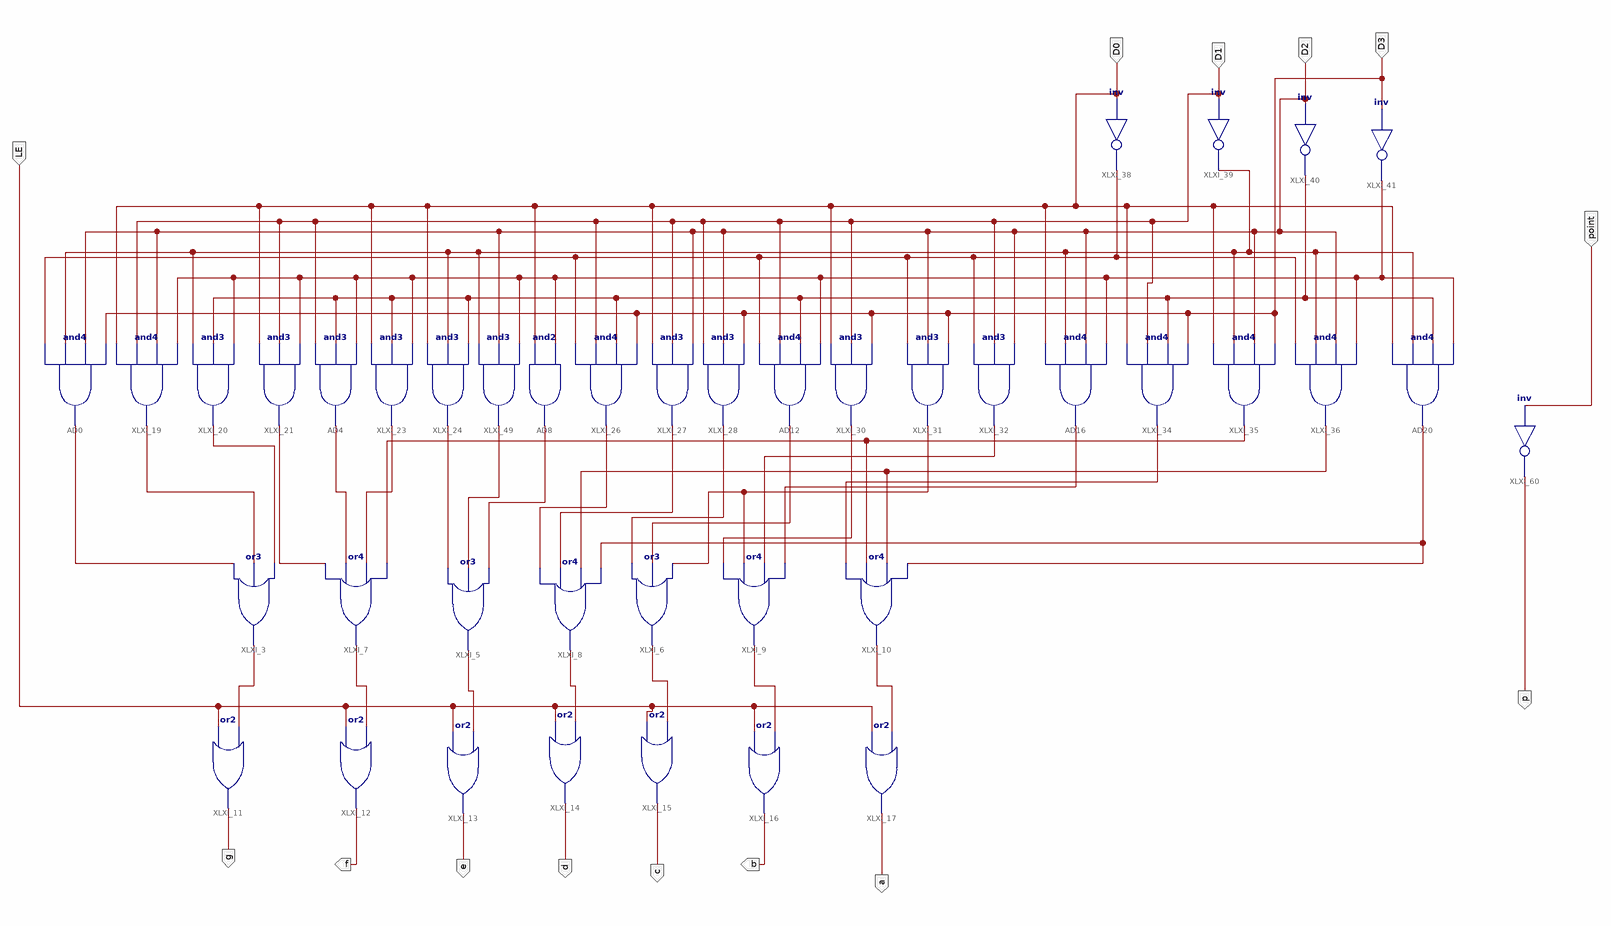
[diagram p0: schematic sheet 1]
// Xilinx ISE schematic MyMC14495.sch (kintex7) as structural Verilog: 40 symbols, 14 ports
module MyMC14495 (
  input  D0,
  input  D1,
  input  D2,
  input  D3,
  input  LE,
  input  point,
  output g,
  output f,
  output e,
  output d,
  output c,
  output b,
  output a,
  output p
);

  wire XLXN_1, XLXN_2, XLXN_3, XLXN_4, XLXN_5, XLXN_6, XLXN_7, XLXN_8, XLXN_17, XLXN_24, XLXN_32, XLXN_33,
       XLXN_34, XLXN_36, XLXN_38, XLXN_39, XLXN_40, XLXN_41, XLXN_42, XLXN_43, XLXN_44, XLXN_45, XLXN_46,
       XLXN_47, XLXN_48, XLXN_50, XLXN_51, XLXN_52, XLXN_53, XLXN_54, XLXN_55, XLXN_57;

  or XLXI_3 (XLXN_1, XLXN_33, XLXN_34, XLXN_36);
  or XLXI_5 (XLXN_3, XLXN_41, XLXN_42, XLXN_43);
  or XLXI_6 (XLXN_5, XLXN_46, XLXN_47, XLXN_50);
  or XLXI_7 (XLXN_2, XLXN_38, XLXN_39, XLXN_40, XLXN_54);
  or XLXI_8 (XLXN_4, XLXN_44, XLXN_45, XLXN_55, XLXN_57);
  or XLXI_9 (XLXN_6, XLXN_48, XLXN_50, XLXN_51, XLXN_52);
  or XLXI_10 (XLXN_7, XLXN_53, XLXN_54, XLXN_55, XLXN_57);
  or XLXI_11 (g, LE, XLXN_1);
  or XLXI_12 (f, LE, XLXN_2);
  or XLXI_13 (e, LE, XLXN_3);
  or XLXI_14 (d, LE, XLXN_4);
  or XLXI_15 (c, LE, XLXN_5);
  or XLXI_16 (b, LE, XLXN_6);
  or XLXI_17 (a, LE, XLXN_7);
  and AD8 (XLXN_43, D0, XLXN_32);
  and XLXI_26 (XLXN_44, XLXN_8, D1, XLXN_24, D3);
  and XLXI_27 (XLXN_45, D0, D1, D2);
  and XLXI_28 (XLXN_46, D1, D2, D3);
  and AD12 (XLXN_47, XLXN_8, D1, XLXN_24, XLXN_32);
  and XLXI_30 (XLXN_48, D0, D1, D3);
  and XLXI_31 (XLXN_50, XLXN_8, D2, D3);
  and XLXI_32 (XLXN_51, XLXN_8, D1, D2);
  and AD16 (XLXN_52, D0, XLXN_17, D2, XLXN_32);
  and XLXI_34 (XLXN_53, D0, D1, XLXN_24, D3);
  and XLXI_35 (XLXN_54, D0, XLXN_17, D2, D3);
  and XLXI_36 (XLXN_55, XLXN_8, XLXN_17, D2, XLXN_32);
  and AD20 (XLXN_57, D0, XLXN_17, XLXN_24, XLXN_32);
  not XLXI_38 (XLXN_8, D0);
  not XLXI_39 (XLXN_17, D1);
  not XLXI_40 (XLXN_24, D2);
  not XLXI_41 (XLXN_32, D3);
  and AD0 (XLXN_33, XLXN_8, XLXN_17, D2, D3);
  and XLXI_19 (XLXN_34, D0, D1, D2, XLXN_32);
  and XLXI_20 (XLXN_36, XLXN_17, XLXN_24, XLXN_32);
  and XLXI_21 (XLXN_38, D0, D1, XLXN_32);
  and AD4 (XLXN_39, D1, XLXN_24, XLXN_32);
  and XLXI_23 (XLXN_40, D0, XLXN_24, XLXN_32);
  and XLXI_24 (XLXN_41, D0, XLXN_17, XLXN_24);
  and XLXI_49 (XLXN_42, XLXN_17, D2, XLXN_32);
  not XLXI_60 (p, point);
endmodule
